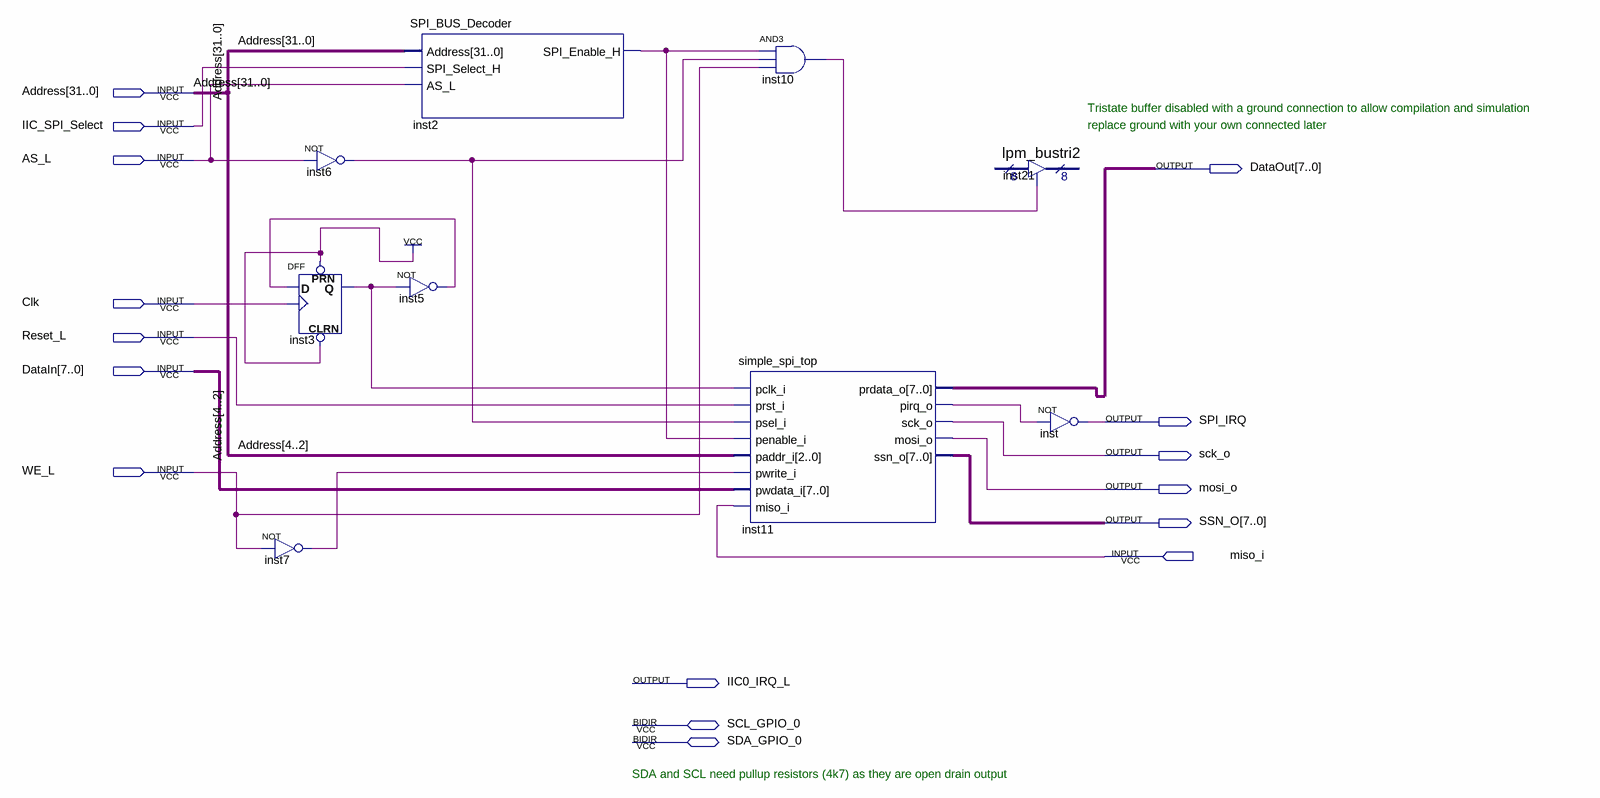
[diagram p0: schematic sheet]
// Quartus schematic IIC_SPI_Interface.bdf as structural Verilog: 9 symbols, 16 pins
module IIC_SPI_Interface (
  input  [31:0] Address,
  input  IIC_SPI_Select,
  input  AS_L,
  input  Clk,
  input  Reset_L,
  input  [7:0] DataIn,
  input  WE_L,
  input  miso_i,
  inout  SCL_GPIO_0,
  inout  SDA_GPIO_0,
  output [7:0] DataOut,
  output SPI_IRQ,
  output sck_o,
  output mosi_o,
  output [7:0] SSN_O,
  output IIC0_IRQ_L
);

  wire inst2_spi_enable_h, inst3_q, inst5_out, inst6_out, inst7_out, inst10_out, inst11_pirq_o;

  not inst7 (inst7_out, WE_L);
  not inst6 (inst6_out, AS_L);
  DFF inst3 (.CLRN(1'b1), .CLK(Clk), .D(inst5_out), .PRN(1'b1), .Q(inst3_q));
  SPI_BUS_Decoder inst2 (
    .Address(Address), .SPI_Select_H(IIC_SPI_Select), .AS_L(AS_L), .SPI_Enable_H(inst2_spi_enable_h));
  not inst5 (inst5_out, inst3_q);
  simple_spi_top inst11 (
    .pclk_i(inst3_q), .prst_i(Reset_L), .psel_i(inst6_out), .penable_i(inst2_spi_enable_h),
    .paddr_i(Address[4:2]), .pwrite_i(inst7_out), .pwdata_i(DataIn), .miso_i(miso_i), .prdata_o(DataOut),
    .pirq_o(inst11_pirq_o), .sck_o(sck_o), .mosi_o(mosi_o), .ssn_o(SSN_O));
  and inst10 (inst10_out, inst2_spi_enable_h, inst6_out, WE_L);
  lpm_bustri2 inst21 (.enabledt(inst10_out));  // open: data, tridata
  not inst (SPI_IRQ, inst11_pirq_o);

  // Notes on the sheet:
  //   Tristate buffer disabled with a ground connection to allow compilation and simulation
  //   replace ground with your own connected later
  //   SDA and SCL need pullup resistors (4k7) as they are open drain output
endmodule
